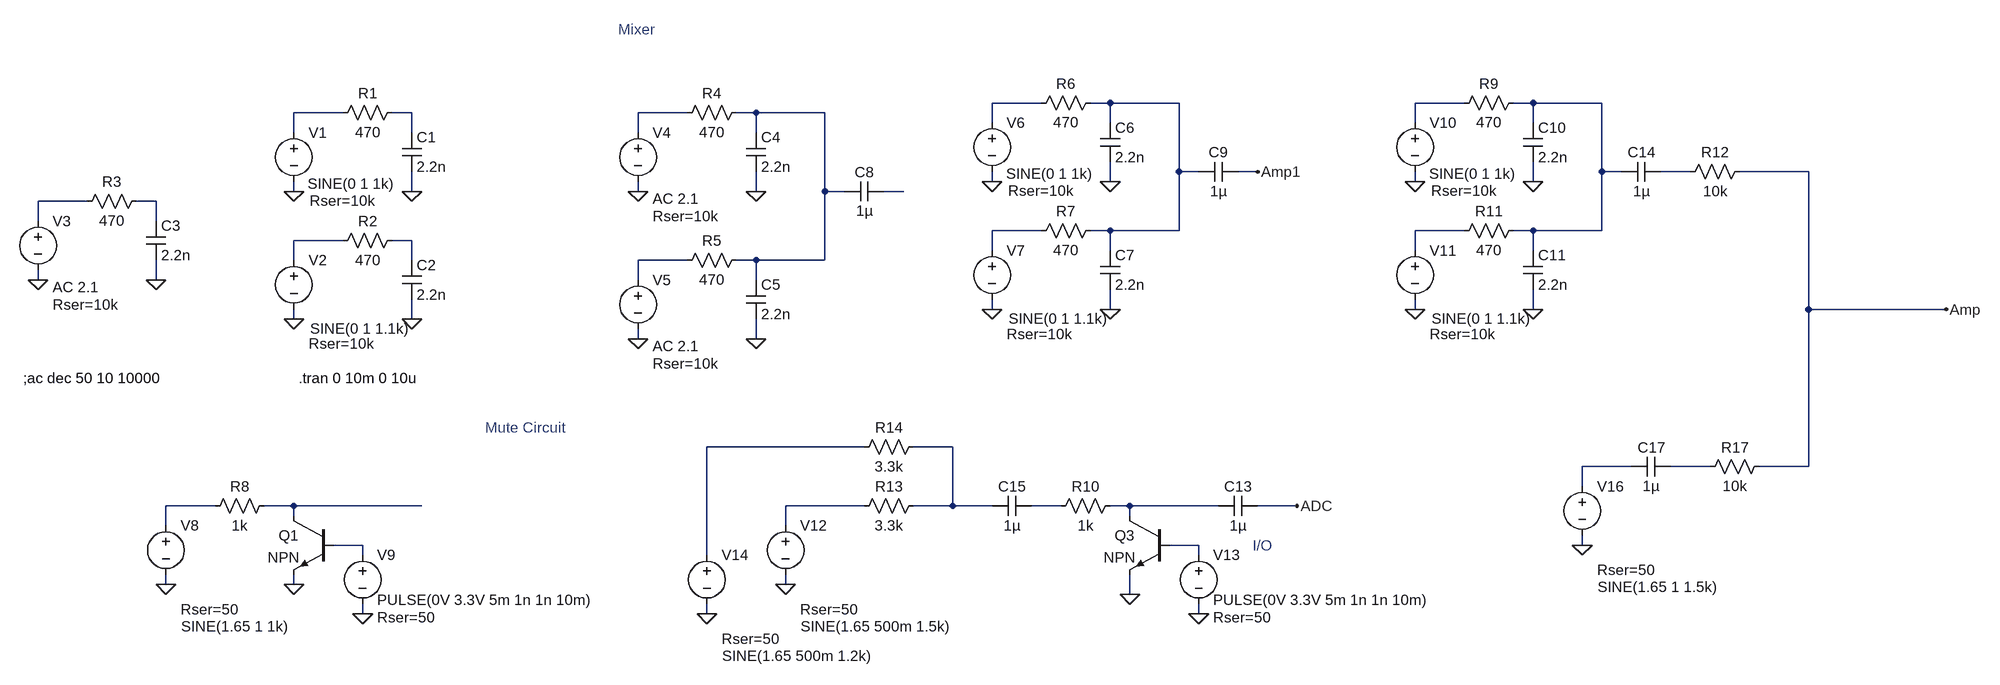
[diagram p0: schematic DAC_output_sims.asc]
DAC_output_sims.asc, the LTspice schematic file:
Version 4
SHEET 1 2756 1280
WIRE 1216 -128 1136 -128
WIRE 1328 -128 1296 -128
WIRE 1440 -128 1328 -128
WIRE 1904 -128 1824 -128
WIRE 2016 -128 1984 -128
WIRE 2128 -128 2016 -128
WIRE 80 -112 0 -112
WIRE 192 -112 160 -112
WIRE 640 -112 560 -112
WIRE 752 -112 720 -112
WIRE 864 -112 752 -112
WIRE 1136 -96 1136 -128
WIRE 1328 -96 1328 -128
WIRE 1824 -96 1824 -128
WIRE 2016 -96 2016 -128
WIRE 0 -80 0 -112
WIRE 192 -80 192 -112
WIRE 560 -80 560 -112
WIRE 752 -80 752 -112
WIRE 1440 -16 1440 -128
WIRE 1472 -16 1440 -16
WIRE 1568 -16 1536 -16
WIRE 2128 -16 2128 -128
WIRE 2160 -16 2128 -16
WIRE 2272 -16 2224 -16
WIRE 2464 -16 2352 -16
WIRE 1136 0 1136 -16
WIRE 1328 0 1328 -32
WIRE 1824 0 1824 -16
WIRE 2016 0 2016 -32
WIRE 0 16 0 0
WIRE 192 16 192 -16
WIRE 560 16 560 0
WIRE 752 16 752 -16
WIRE 864 16 864 -112
WIRE 896 16 864 16
WIRE 992 16 960 16
WIRE -336 32 -416 32
WIRE -224 32 -256 32
WIRE -416 64 -416 32
WIRE -224 64 -224 32
WIRE 1216 80 1136 80
WIRE 1328 80 1296 80
WIRE 1440 80 1440 -16
WIRE 1440 80 1328 80
WIRE 1904 80 1824 80
WIRE 2016 80 1984 80
WIRE 2128 80 2128 -16
WIRE 2128 80 2016 80
WIRE 80 96 0 96
WIRE 192 96 160 96
WIRE 1136 112 1136 80
WIRE 1328 112 1328 80
WIRE 1824 112 1824 80
WIRE 2016 112 2016 80
WIRE 0 128 0 96
WIRE 192 128 192 96
WIRE 640 128 560 128
WIRE 752 128 720 128
WIRE 864 128 864 16
WIRE 864 128 752 128
WIRE -416 160 -416 144
WIRE -224 160 -224 128
WIRE 560 160 560 128
WIRE 752 160 752 128
WIRE 1136 208 1136 192
WIRE 1328 208 1328 176
WIRE 1824 208 1824 192
WIRE 2016 208 2016 176
WIRE 2464 208 2464 -16
WIRE 2688 208 2464 208
WIRE 0 224 0 208
WIRE 192 224 192 192
WIRE 560 256 560 240
WIRE 752 256 752 224
WIRE 928 432 672 432
WIRE 1072 432 1008 432
WIRE 2176 464 2096 464
WIRE 2304 464 2240 464
WIRE 2464 464 2464 208
WIRE 2464 464 2384 464
WIRE 2096 496 2096 464
WIRE -128 528 -208 528
WIRE 0 528 -48 528
WIRE 208 528 0 528
WIRE 928 528 800 528
WIRE 1072 528 1072 432
WIRE 1072 528 1008 528
WIRE 1136 528 1072 528
WIRE 1248 528 1200 528
WIRE 1360 528 1328 528
WIRE 1504 528 1360 528
WIRE 1632 528 1568 528
WIRE 0 544 0 528
WIRE 1360 544 1360 528
WIRE -208 560 -208 528
WIRE 800 560 800 528
WIRE 112 592 64 592
WIRE 1472 592 1424 592
WIRE 2096 592 2096 576
WIRE 112 608 112 592
WIRE 672 608 672 432
WIRE 1472 608 1472 592
WIRE -208 656 -208 640
WIRE 0 656 0 640
WIRE 800 656 800 640
WIRE 1360 672 1360 640
WIRE 112 704 112 688
WIRE 672 704 672 688
WIRE 1472 704 1472 688
FLAG 0 16 0
FLAG 192 16 0
FLAG 192 224 0
FLAG 0 224 0
FLAG -416 160 0
FLAG -224 160 0
FLAG 560 16 0
FLAG 752 16 0
FLAG 560 256 0
FLAG 752 256 0
FLAG 1136 0 0
FLAG 1328 0 0
FLAG 1328 208 0
FLAG 1136 208 0
FLAG -208 656 0
FLAG 0 656 0
FLAG 112 704 0
FLAG 800 656 0
FLAG 1472 704 0
FLAG 1632 528 ADC
FLAG 1568 -16 Amp1
FLAG 1824 0 0
FLAG 2016 0 0
FLAG 2016 208 0
FLAG 1824 208 0
FLAG 2688 208 Amp
FLAG 2096 592 0
FLAG 1360 672 0
FLAG 672 704 0
SYMBOL res 64 -96 R270
WINDOW 0 32 56 VTop 2
WINDOW 3 0 56 VBottom 2
SYMATTR InstName R1
SYMATTR Value 470
SYMBOL res 64 112 R270
WINDOW 0 32 56 VTop 2
WINDOW 3 0 56 VBottom 2
SYMATTR InstName R2
SYMATTR Value 470
SYMBOL cap 176 -80 R0
SYMATTR InstName C1
SYMATTR Value 2.2n
SYMBOL cap 176 128 R0
SYMATTR InstName C2
SYMATTR Value 2.2n
SYMBOL voltage 0 -96 R0
WINDOW 3 23 99 Left 2
WINDOW 123 24 124 Left 2
WINDOW 39 26 127 Left 2
SYMATTR Value SINE(0 1 1k)
SYMATTR SpiceLine Rser=10k
SYMATTR InstName V1
SYMBOL voltage 0 112 R0
WINDOW 3 27 127 Left 2
WINDOW 123 24 124 Left 2
WINDOW 39 24 152 Left 2
SYMATTR Value SINE(0 1 1.1k)
SYMATTR SpiceLine Rser=10k
SYMATTR InstName V2
SYMBOL res -352 48 R270
WINDOW 0 32 56 VTop 2
WINDOW 3 0 56 VBottom 2
SYMATTR InstName R3
SYMATTR Value 470
SYMBOL cap -240 64 R0
SYMATTR InstName C3
SYMATTR Value 2.2n
SYMBOL voltage -416 48 R0
WINDOW 123 24 124 Left 2
WINDOW 39 24 152 Left 2
SYMATTR Value2 AC 2.1
SYMATTR SpiceLine Rser=10k
SYMATTR InstName V3
SYMATTR Value ""
SYMBOL res 624 -96 R270
WINDOW 0 32 56 VTop 2
WINDOW 3 0 56 VBottom 2
SYMATTR InstName R4
SYMATTR Value 470
SYMBOL cap 736 -80 R0
SYMATTR InstName C4
SYMATTR Value 2.2n
SYMBOL voltage 560 -96 R0
WINDOW 123 24 124 Left 2
WINDOW 39 24 152 Left 2
SYMATTR Value2 AC 2.1
SYMATTR SpiceLine Rser=10k
SYMATTR InstName V4
SYMATTR Value ""
SYMBOL res 624 144 R270
WINDOW 0 32 56 VTop 2
WINDOW 3 0 56 VBottom 2
SYMATTR InstName R5
SYMATTR Value 470
SYMBOL cap 736 160 R0
SYMATTR InstName C5
SYMATTR Value 2.2n
SYMBOL voltage 560 144 R0
WINDOW 123 24 124 Left 2
WINDOW 39 24 152 Left 2
SYMATTR Value2 AC 2.1
SYMATTR SpiceLine Rser=10k
SYMATTR InstName V5
SYMATTR Value ""
SYMBOL res 1200 -112 R270
WINDOW 0 32 56 VTop 2
WINDOW 3 0 56 VBottom 2
SYMATTR InstName R6
SYMATTR Value 470
SYMBOL res 1200 96 R270
WINDOW 0 32 56 VTop 2
WINDOW 3 0 56 VBottom 2
SYMATTR InstName R7
SYMATTR Value 470
SYMBOL cap 1312 -96 R0
SYMATTR InstName C6
SYMATTR Value 2.2n
SYMBOL cap 1312 112 R0
SYMATTR InstName C7
SYMATTR Value 2.2n
SYMBOL voltage 1136 -112 R0
WINDOW 3 23 99 Left 2
WINDOW 123 24 124 Left 2
WINDOW 39 26 127 Left 2
SYMATTR Value SINE(0 1 1k)
SYMATTR SpiceLine Rser=10k
SYMATTR InstName V6
SYMBOL voltage 1136 96 R0
WINDOW 3 27 127 Left 2
WINDOW 123 24 124 Left 2
WINDOW 39 24 152 Left 2
SYMATTR Value SINE(0 1 1.1k)
SYMATTR SpiceLine Rser=10k
SYMATTR InstName V7
SYMBOL cap 896 32 R270
WINDOW 0 32 32 VTop 2
WINDOW 3 0 32 VBottom 2
SYMATTR InstName C8
SYMATTR Value 1µ
SYMBOL cap 1472 0 R270
WINDOW 0 32 32 VTop 2
WINDOW 3 0 32 VBottom 2
SYMATTR InstName C9
SYMATTR Value 1µ
SYMBOL npn 64 544 M0
SYMATTR InstName Q1
SYMBOL res -144 544 R270
WINDOW 0 32 56 VTop 2
WINDOW 3 0 56 VBottom 2
SYMATTR InstName R8
SYMATTR Value 1k
SYMBOL voltage -208 544 R0
WINDOW 123 24 124 Left 2
WINDOW 39 24 152 Left 2
WINDOW 3 25 180 Left 2
SYMATTR SpiceLine Rser=50
SYMATTR Value SINE(1.65 1 1k)
SYMATTR InstName V8
SYMBOL voltage 112 592 R0
WINDOW 123 24 124 Left 2
WINDOW 39 24 117 Left 2
WINDOW 3 24 89 Left 2
SYMATTR SpiceLine Rser=50
SYMATTR Value PULSE(0V 3.3V 5m 1n 1n 10m)
SYMATTR InstName V9
SYMBOL npn 1424 544 M0
SYMATTR InstName Q3
SYMBOL res 1232 544 R270
WINDOW 0 32 56 VTop 2
WINDOW 3 0 56 VBottom 2
SYMATTR InstName R10
SYMATTR Value 1k
SYMBOL voltage 800 544 R0
WINDOW 123 24 124 Left 2
WINDOW 39 24 152 Left 2
WINDOW 3 25 180 Left 2
SYMATTR SpiceLine Rser=50
SYMATTR Value SINE(1.65 500m 1.5k)
SYMATTR InstName V12
SYMBOL voltage 1472 592 R0
WINDOW 123 24 124 Left 2
WINDOW 39 24 117 Left 2
WINDOW 3 24 89 Left 2
SYMATTR SpiceLine Rser=50
SYMATTR Value PULSE(0V 3.3V 5m 1n 1n 10m)
SYMATTR InstName V13
SYMBOL cap 1504 544 R270
WINDOW 0 32 32 VTop 2
WINDOW 3 0 32 VBottom 2
SYMATTR InstName C13
SYMATTR Value 1µ
SYMBOL res 1888 -112 R270
WINDOW 0 32 56 VTop 2
WINDOW 3 0 56 VBottom 2
SYMATTR InstName R9
SYMATTR Value 470
SYMBOL res 1888 96 R270
WINDOW 0 32 56 VTop 2
WINDOW 3 0 56 VBottom 2
SYMATTR InstName R11
SYMATTR Value 470
SYMBOL cap 2000 -96 R0
SYMATTR InstName C10
SYMATTR Value 2.2n
SYMBOL cap 2000 112 R0
SYMATTR InstName C11
SYMATTR Value 2.2n
SYMBOL voltage 1824 -112 R0
WINDOW 3 23 99 Left 2
WINDOW 123 24 124 Left 2
WINDOW 39 26 127 Left 2
SYMATTR Value SINE(0 1 1k)
SYMATTR SpiceLine Rser=10k
SYMATTR InstName V10
SYMBOL voltage 1824 96 R0
WINDOW 3 27 127 Left 2
WINDOW 123 24 124 Left 2
WINDOW 39 24 152 Left 2
SYMATTR Value SINE(0 1 1.1k)
SYMATTR SpiceLine Rser=10k
SYMATTR InstName V11
SYMBOL cap 2160 0 R270
WINDOW 0 32 32 VTop 2
WINDOW 3 0 32 VBottom 2
SYMATTR InstName C14
SYMATTR Value 1µ
SYMBOL res 2256 0 R270
WINDOW 0 32 56 VTop 2
WINDOW 3 0 56 VBottom 2
SYMATTR InstName R12
SYMATTR Value 10k
SYMBOL cap 1136 544 R270
WINDOW 0 32 32 VTop 2
WINDOW 3 0 32 VBottom 2
SYMATTR InstName C15
SYMATTR Value 1µ
SYMBOL voltage 2096 480 R0
WINDOW 123 24 124 Left 2
WINDOW 39 24 152 Left 2
WINDOW 3 25 180 Left 2
SYMATTR SpiceLine Rser=50
SYMATTR Value SINE(1.65 1 1.5k)
SYMATTR InstName V16
SYMBOL cap 2176 480 R270
WINDOW 0 32 32 VTop 2
WINDOW 3 0 32 VBottom 2
SYMATTR InstName C17
SYMATTR Value 1µ
SYMBOL res 2288 480 R270
WINDOW 0 32 56 VTop 2
WINDOW 3 0 56 VBottom 2
SYMATTR InstName R17
SYMATTR Value 10k
SYMBOL voltage 672 592 R0
WINDOW 123 24 124 Left 2
WINDOW 39 24 152 Left 2
WINDOW 3 25 180 Left 2
SYMATTR SpiceLine Rser=50
SYMATTR Value SINE(1.65 500m 1.2k)
SYMATTR InstName V14
SYMBOL res 912 544 R270
WINDOW 0 32 56 VTop 2
WINDOW 3 0 56 VBottom 2
SYMATTR InstName R13
SYMATTR Value 3.3k
SYMBOL res 912 448 R270
WINDOW 0 32 56 VTop 2
WINDOW 3 0 56 VBottom 2
SYMATTR InstName R14
SYMATTR Value 3.3k
TEXT -440 320 Left 2 !;ac dec 50 10 10000
TEXT 8 320 Left 2 !.tran 0 10m 0 10u
TEXT 528 -248 Left 2 ;Mixer
TEXT 376 400 Center 2 ;Mute Circuit
TEXT 1560 592 Left 2 ;I/O

The netlist it stands for:
* DAC_output_sims.asc
R1 N005 N006 470
R2 N015 N016 470
C1 N006 0 2.2n
C2 N016 0 2.2n
V1 N005 0 SINE(0 1 1k) Rser=10k
V2 N015 0 SINE(0 1 1.1k) Rser=10k
R3 N011 N012 470
C3 N012 0 2.2n
V3 N011 0 AC 2.1 Rser=10k
R4 N007 N008 470
C4 N008 0 2.2n
V4 N007 0 AC 2.1 Rser=10k
R5 N017 N008 470
C5 N008 0 2.2n
V5 N017 0 AC 2.1 Rser=10k
R6 N001 N002 470
R7 N013 N002 470
C6 N002 0 2.2n
C7 N002 0 2.2n
V6 N001 0 SINE(0 1 1k) Rser=10k
V7 N013 0 SINE(0 1 1.1k) Rser=10k
C8 N008 N010 1µ
C9 N002 Amp1 1µ
Q1 N023 N027 0 0 NPN
R8 N022 N023 1k
V8 N022 0 SINE(1.65 1 1k) Rser=50
V9 N027 0 PULSE(0V 3.3V 5m 1n 1n 10m) Rser=50
Q3 N026 N028 0 0 NPN
R10 N025 N026 1k
V12 N024 0 SINE(1.65 500m 1.5k) Rser=50
V13 N028 0 PULSE(0V 3.3V 5m 1n 1n 10m) Rser=50
C13 N026 ADC 1µ
R9 N003 N004 470
R11 N014 N004 470
C10 N004 0 2.2n
C11 N004 0 2.2n
V10 N003 0 SINE(0 1 1k) Rser=10k
V11 N014 0 SINE(0 1 1.1k) Rser=10k
C14 N004 N009 1µ
R12 N009 Amp 10k
C15 N019 N025 1µ
V16 N020 0 SINE(1.65 1 1.5k) Rser=50
C17 N020 N021 1µ
R17 N021 Amp 10k
V14 N018 0 SINE(1.65 500m 1.2k) Rser=50
R13 N024 N019 3.3k
R14 N018 N019 3.3k
.model NPN NPN
.model PNP PNP
.lib standard.bjt
;ac dec 50 10 10000
.tran 0 10m 0 10u
* Mixer
* Mute Circuit
* I/O
.backanno
.end